# EAGLE design Step Stick (EAGLE 8.0.0)
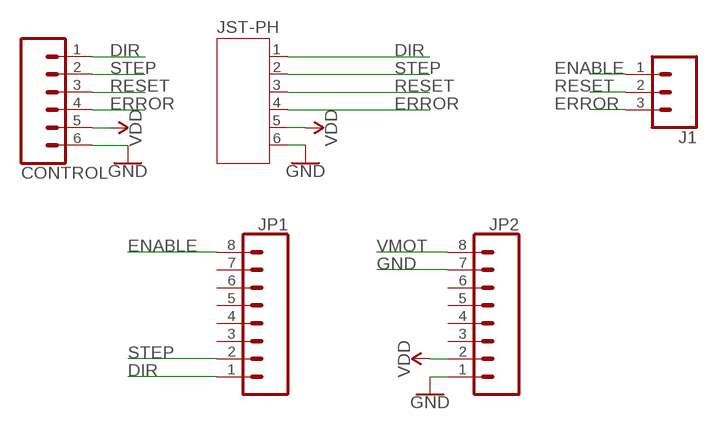
[diagram p0: schematic, sheet 1]

## Parts
CONTROL  CONN_06NO_SILK_FEMALE_PTH  [1X06_NO_SILK]
J1  CONN_031X03_NO_SILK  [1X03_NO_SILK]
JP1  CONN_08NO_SILK_FEMALE_PTH  [1X08_NO_SILK]
JP2  CONN_08NO_SILK_FEMALE_PTH  [1X08_NO_SILK]
JST-PH  JST-PH6  [JST-PH6]

## Nets
DIR: CONTROL.1 JP1.1 JST-PH.1
ENABLE: J1.1 JP1.8
ERROR: CONTROL.4 J1.3 JST-PH.4
GND: CONTROL.6 JP2.1 JP2.7 JST-PH.6
RESET: CONTROL.3 J1.2 JST-PH.3
STEP: CONTROL.2 JP1.2 JST-PH.2
VDD: CONTROL.5 JP2.2 JST-PH.5
VMOT: JP2.8
Unconnected: JP1.3 JP1.4 JP1.5 JP1.6 JP1.7 JP2.3 JP2.4 JP2.5 JP2.6

## Library data of the parts
CONTROL = SparkFun-Connectors:CONN_06: Multi connection point. Often used as Generic Header-pin footprint for 0.1 inch spaced/style header connections On any of the 0.1 inch spaced packages, you can populate with these: Break Away Headers - Straight <https://www.sparkfun.com/products/116> (PRT-00116) Break Away Male Headers - Right Angle <https://www.sparkfun.com/products/553> (PRT-00553) Female Headers <https://www.sparkfun.com/products/115> (PRT-00115) Break Away Headers - Machine Pin <https://www.sparkfun.com/products/117> (PRT-00117) Break Away Female Headers - Swiss Machine Pin <https://www.sparkfun.com/products/743> (PRT-00743) Arduino Stackable Header - 6 Pin <https://www.sparkfun.com/products/9280> (PRT-09280) For SCREWTERMINALS and SPRING TERMINALS visit here: Screw Terimnals on SparkFun.com <https://www.sparkfun.com/search/results?term=Screw+Terminals> (5mm/3.5mm/2.54mm spacing) This device is also useful as a general connection point to wire up your design to another part of your project. Our various solder wires solder well into these plated through hole pads. Hook-Up Wire - Assortment (Stranded, 22 AWG) <https://www.sparkfun.com/products/11375> (PRT-11375) Hook-Up Wire - Assortment (Solid Core, 22 AWG) <https://www.sparkfun.com/products/11367> (PRT-11367) View the entire wire category on our website here <https://www.sparkfun.com/categories/141>; PROD_ID: CONN-08437
J1 = SparkFun-Connectors:CONN_03: Multi connection point. Often used as Generic Header-pin footprint for 0.1 inch spaced/style header connections On any of the 0.1 inch spaced packages, you can populate with these: Break Away Headers - Straight <https://www.sparkfun.com/products/116> (PRT-00116) Break Away Male Headers - Right Angle <https://www.sparkfun.com/products/553> (PRT-00553) Female Headers <https://www.sparkfun.com/products/115> (PRT-00115) Break Away Headers - Machine Pin <https://www.sparkfun.com/products/117> (PRT-00117) Break Away Female Headers - Swiss Machine Pin <https://www.sparkfun.com/products/743> (PRT-00743) Stackable Header - 3 Pin (Female, 0.1") <https://www.sparkfun.com/products/13875> (PRT-13875) For SCREWTERMINALS and SPRING TERMINALS visit here: Screw Terimnals on SparkFun.com <https://www.sparkfun.com/search/results?term=Screw+Terminals> (5mm/3.5mm/2.54mm spacing) This device is also useful as a general connection point to wire up your design to another part of your project. Our various solder wires solder well into these plated through hole pads. Hook-Up Wire - Assortment (Stranded, 22 AWG) <https://www.sparkfun.com/products/11375> (PRT-11375) Hook-Up Wire - Assortment (Solid Core, 22 AWG) <https://www.sparkfun.com/products/11367> (PRT-11367) View the entire wire category on our website here <https://www.sparkfun.com/categories/141> Special notes: Molex polarized connector foot print use with SKU : PRT-08232 with associated crimp pins and housings.
JP1 JP2 = SparkFun-Connectors:CONN_08: Multi connection point. Often used as Generic Header-pin footprint for 0.1 inch spaced/style header connections On any of the 0.1 inch spaced packages, you can populate with these: Break Away Headers - Straight <https://www.sparkfun.com/products/116> (PRT-00116) Break Away Male Headers - Right Angle <https://www.sparkfun.com/products/553> (PRT-00553) Female Headers <https://www.sparkfun.com/products/115> (PRT-00115) Break Away Headers - Machine Pin <https://www.sparkfun.com/products/117> (PRT-00117) Break Away Female Headers - Swiss Machine Pin <https://www.sparkfun.com/products/743> (PRT-00743) Arduino Stackable Header - 8 Pin <https://www.sparkfun.com/products/9279> (PRT-09279) For SCREWTERMINALS and SPRING TERMINALS visit here: Screw Terimnals on SparkFun.com <https://www.sparkfun.com/search/results?term=Screw+Terminals> (5mm/3.5mm/2.54mm spacing) This device is also useful as a general connection point to wire up your design to another part of your project. Our various solder wires solder well into these plated through hole pads. Hook-Up Wire - Assortment (Stranded, 22 AWG) <https://www.sparkfun.com/products/11375> (PRT-11375) Hook-Up Wire - Assortment (Solid Core, 22 AWG) <https://www.sparkfun.com/products/11367> (PRT-11367) View the entire wire category on our website here <https://www.sparkfun.com/categories/141> Special notes: Molex polarized connector foot print use with SKU : PRT-08231 with associated crimp pins and housings. 1MM SMD Version SKU: PRT-10208 NOTES ON THE VARIANTS LOCK and LOCK_LONGPADS... This footprint was designed to help hold the alignment of a through-hole component (i.e. 6-pin header) while soldering it into place. You may notice that each hole has been shifted either up or down by 0.005 of an inch from it's more standard position (which is a perfectly straight line). This slight alteration caused the pins (the squares in the middle) to touch the edges of the holes. Because they are alternating, it causes a "brace" to hold the component in place. 0.005 has proven to be the perfect amount of "off-center" position when using our standard breakaway headers. Although looks a little odd when you look at the bare footprint, once you have a header in there, the alteration is very hard to notice. Also,if you push a header all the way into place, it is covered up entirely on the bottom side.; PROD_ID: CONN-08438
JST-PH = jst-ph:JST-PH6

## Board
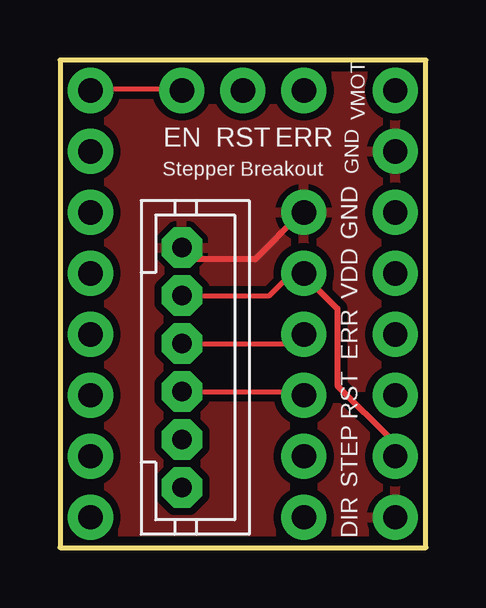
[diagram p1: board, top side]
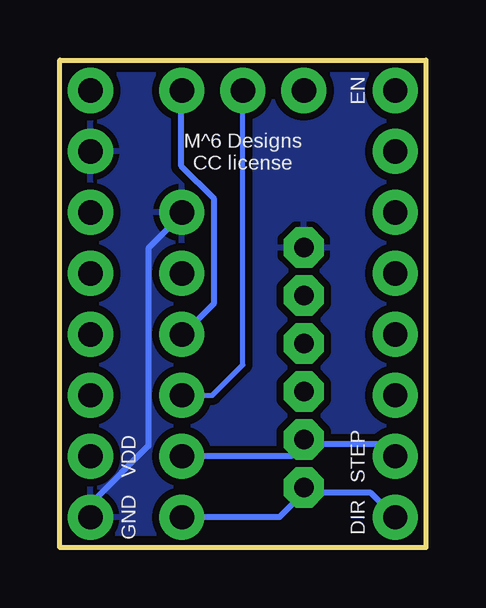
[diagram p2: board, bottom side, seen from below]

Size 15.24 x 20.32 mm. Coordinates in mm from the lower left corner, seen from the top.
Outline: 0,0 15.24,0 15.24,20.32 0,20.32 0,0
Copper layers (1*16): Top 0.0356mm / dielectric 1.5011mm / Bottom 0.0356mm
Design rules "LaenPCBOrder": minimum track width 6mil, minimum drill 13mil, track to track 6mil, track to pad 6mil, pad to pad 6mil, via to via 6mil, smd to smd 6mil, copper to edge 15mil, drill to drill 6mil, minimum pad ring 7mil, minimum via ring 7mil, stop-mask expansion 3mil, vias tented up to drill 0mil, thermal gap 10mil

### Footprints (pad centres in the part's own frame; a part is rotated, then mirrored left to right if it is on the bottom)
1X06_NO_SILK = drill 1.016 pad 1.88: 1 0,0; 2 2.54,0; 3 5.08,0; 4 7.62,0; 5 10.16,0; 6 12.7,0
1X03_NO_SILK = drill 1.016 pad 1.88: 1 0,0; 2 2.54,0; 3 5.08,0
1X08_NO_SILK = drill 1.016 pad 1.88: 1 0,0; 2 2.54,0; 3 5.08,0; 4 7.62,0; 5 10.16,0; 6 12.7,0; 7 15.24,0; 8 17.78,0
JST-PH6 = drill 0.813 pad 1.676 octagon: 1 5,0; 2 3,0; 3 1,0; 4 -1,0; 5 -3,0; 6 -5,0

### Placement (x,y rotation side)
CONTROL  10.16,1.27 90 top
J1  5.08,19.05 0 top
JP1  1.27,1.27 90 top
JP2  13.97,1.27 90 top
JST-PH  5.08,7.51 270 top

### Tracks (layer width: path | path; a pad name or v marks a point on that pad's centre or on a via)
DIR
  Bottom 0.254: 5.08,2.29 2.29,2.29 JP1.1 | CONTROL.1 6.1,1.27 5.08,2.29 | 5.08,2.29 JST-PH.1
ENABLE
  Top 0.203: 5.16,19.1 1.27,19.1
  Top 0.254: 1.27,19.1 JP1.8 | 5.16,19.1 J1.1
ERROR
  Top 0.203: JST-PH.4 10.16,8.51 CONTROL.4
  Bottom 0.254: J1.3 10.18,18.87 10.18,15.9 8.81,14.53 8.81,10.18 9.96,9.04 CONTROL.4
GND
  Top 0.254: JST-PH.6 5.16,12.01 8.13,12.01 9.96,13.84 CONTROL.6
  Bottom 0.254: JP2.1 13.84,1.27 13.84,1.96 11.56,4.24 11.56,12.47 10.18,13.84 CONTROL.6
  pour Top (isolate 0.305): 0,20.32 15.24,20.32 15.24,0 0,0
  pour Bottom (isolate 0.305): 0,20.32 15.24,20.32 15.24,0 0,0
RESET
  Top 0.203: JST-PH.3 10.16,6.51 CONTROL.3
  Bottom 0.203: CONTROL.3 8.89,6.35 7.62,7.62 J1.2
STEP
  Top 0.254: 9.96,3.79 CONTROL.2
  Bottom 0.254: 5.08,4.32 1.78,4.32 JP1.2 | CONTROL.2 5.59,3.81 5.08,4.32 | 5.08,4.32 JST-PH.2
VDD
  Top 0.203: JST-PH.5 8.73,10.51 9.65,11.43
  Top 0.254: 9.96,11.33 CONTROL.5 | JP2.2 13.84,4.01 13.84,4.47 11.56,6.76 11.56,9.96 10.18,11.33 CONTROL.5 | 9.65,11.43 CONTROL.5

### Text on the board
tPlace: VMOT | EN | RST | ERR | GND | Stepper Breakout | GND | VDD | ERR | RST | STEP | DIR
bPlace: EN | M^6 Designs / CC license | STEP | VDD | DIR | GND